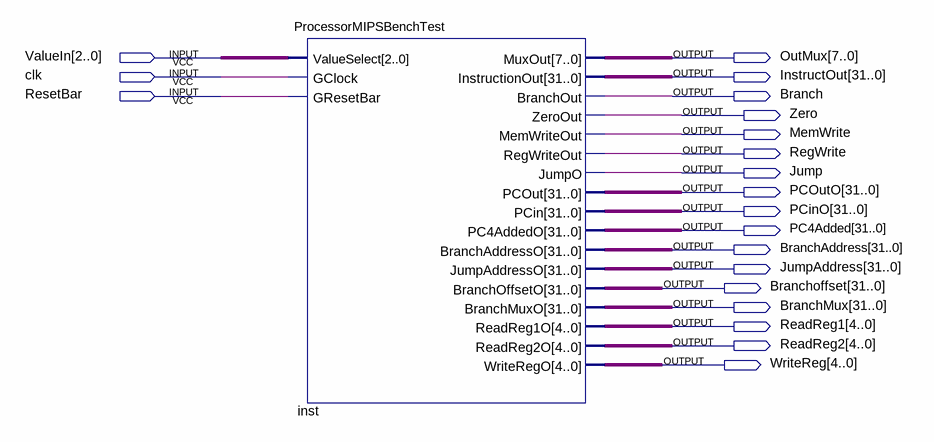
[diagram p0: schematic sheet]
// Quartus schematic testBlock.bdf as structural Verilog: 1 symbols, 20 pins
module testBlock (
  input  [2:0] ValueIn,
  input  clk,
  input  ResetBar,
  output [7:0] OutMux,
  output [31:0] InstructOut,
  output Branch,
  output Zero,
  output MemWrite,
  output RegWrite,
  output Jump,
  output [31:0] PCOutO,
  output [31:0] PCinO,
  output [31:0] PC4Added,
  output [31:0] BranchAddress,
  output [31:0] JumpAddress,
  output [31:0] Branchoffset,
  output [31:0] BranchMux,
  output [4:0] ReadReg1,
  output [4:0] ReadReg2,
  output [4:0] WriteReg
);

  ProcessorMIPSBenchTest inst (
    .ValueSelect(ValueIn), .GClock(clk), .GResetBar(ResetBar), .MuxOut(OutMux), .InstructionOut(InstructOut),
    .BranchOut(Branch), .ZeroOut(Zero), .MemWriteOut(MemWrite), .RegWriteOut(RegWrite), .JumpO(Jump),
    .PCOut(PCOutO), .PCin(PCinO), .PC4AddedO(PC4Added), .BranchAddressO(BranchAddress),
    .JumpAddressO(JumpAddress), .BranchOffsetO(Branchoffset), .BranchMuxO(BranchMux), .ReadReg1O(ReadReg1),
    .ReadReg2O(ReadReg2), .WriteRegO(WriteReg));
endmodule
